# EAGLE schematic fpga_shield (EAGLE 9.2.2)
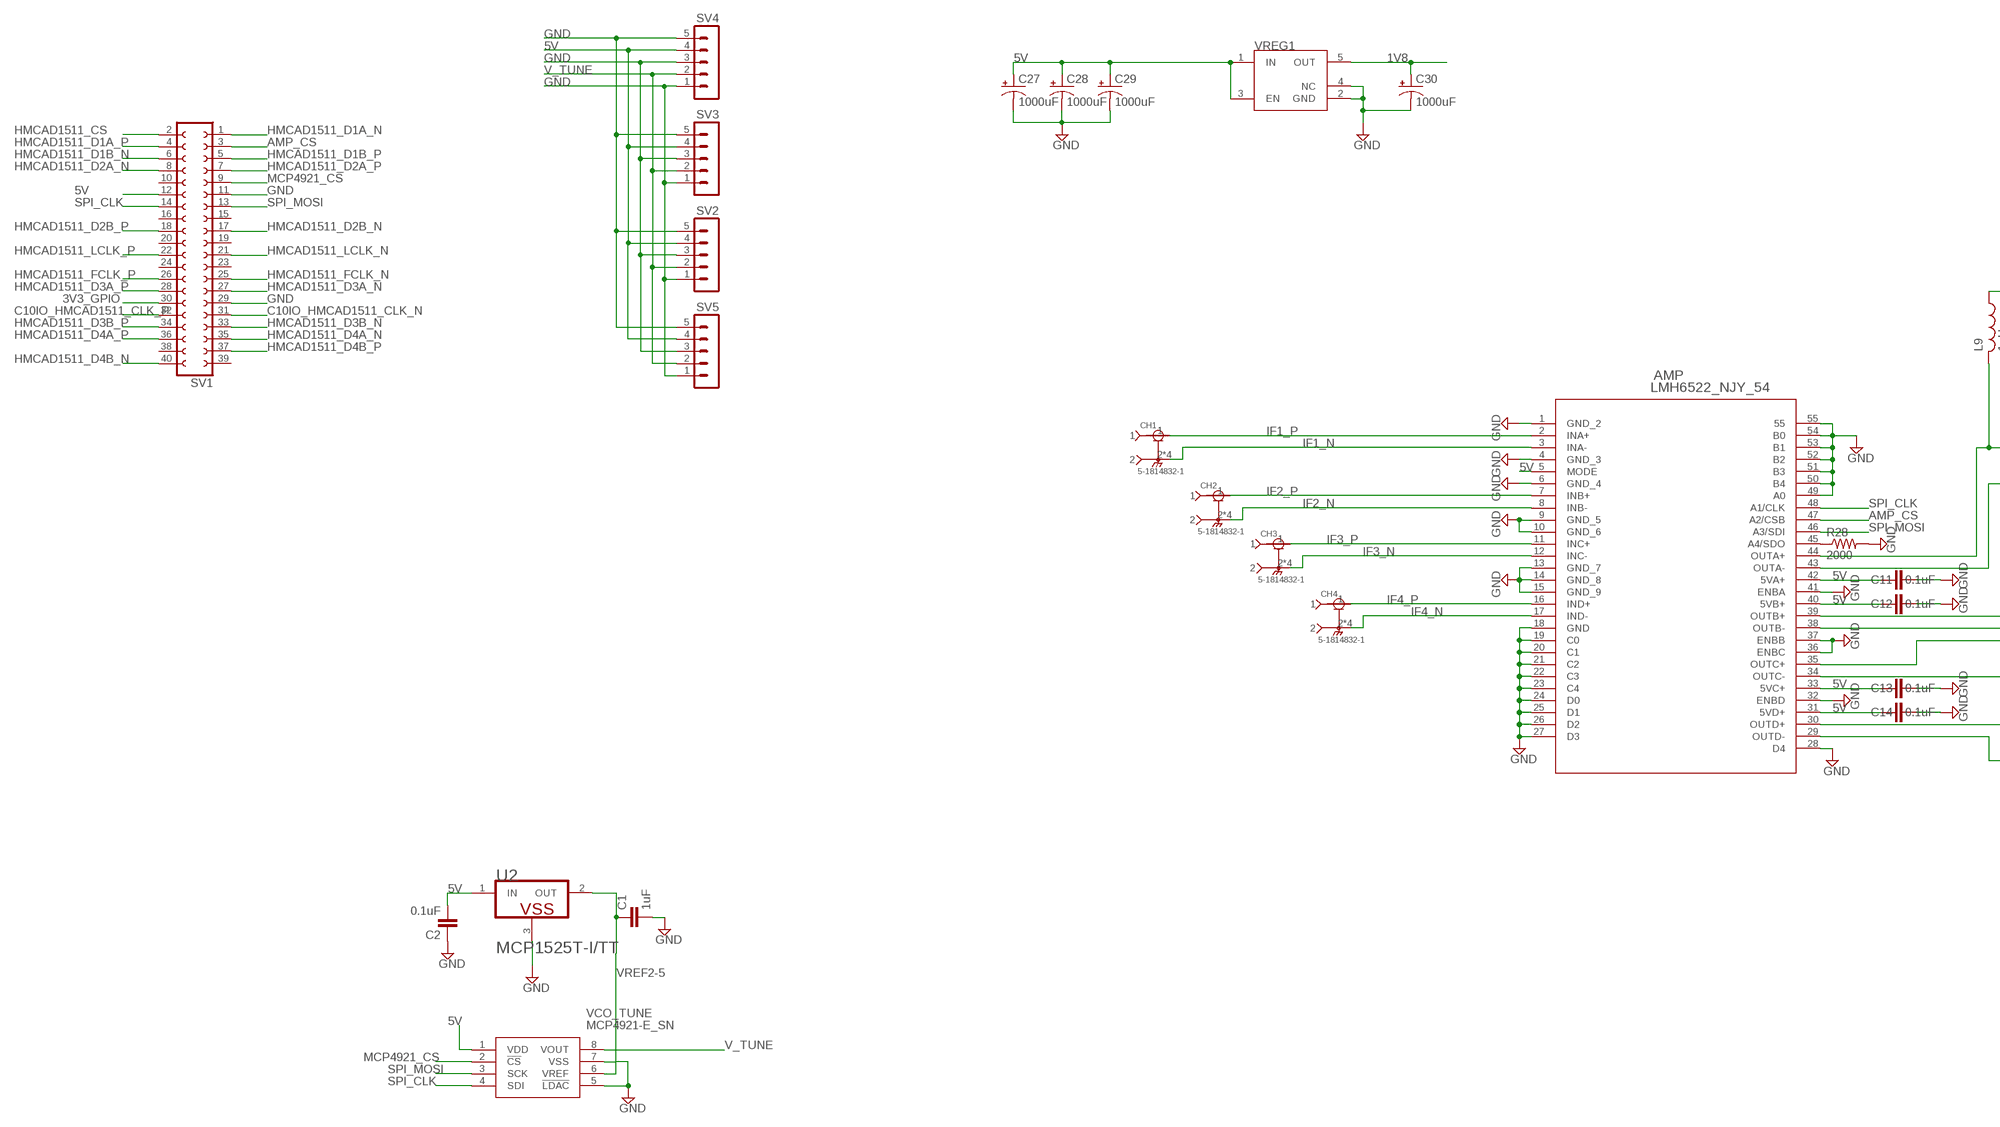
[diagram p0: schematic, sheet 1, part 1 of 2]
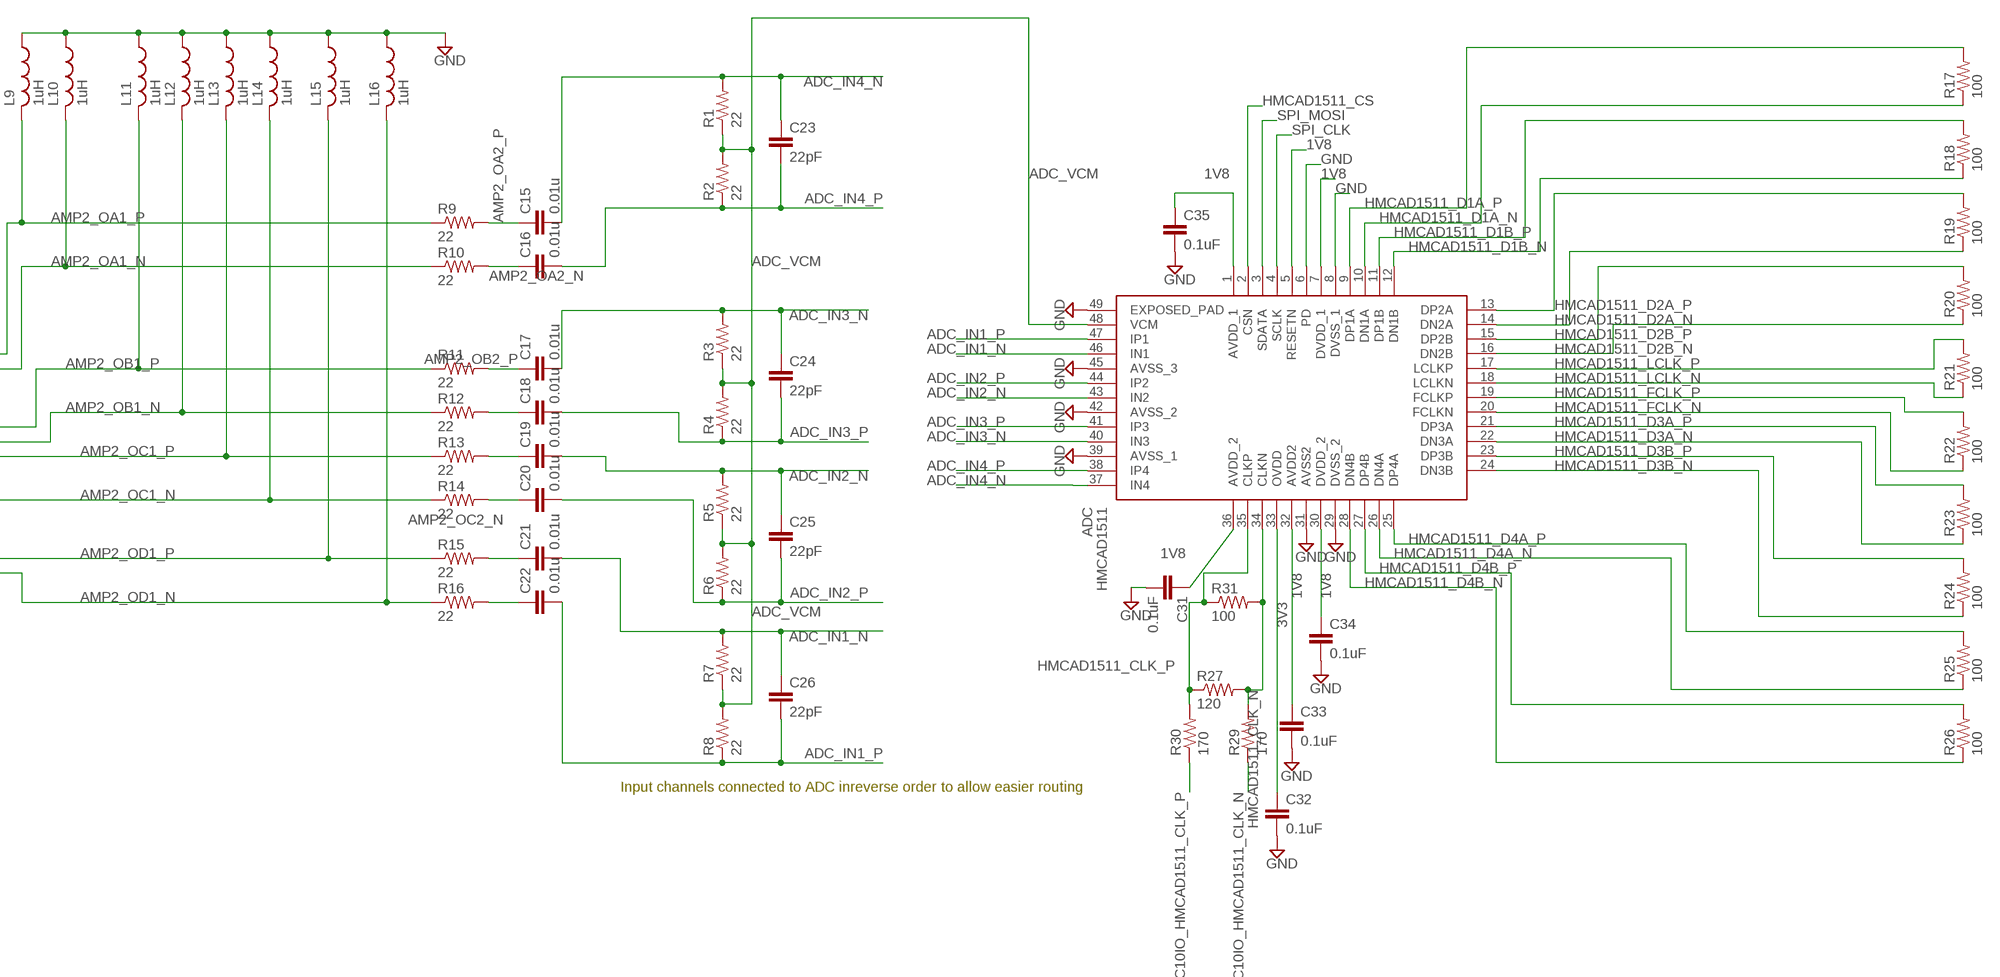
[diagram p1: schematic, sheet 1, part 2 of 2]

## Parts
ADC  HMCAD1511  [QFN50P700X700X100-49N]
AMP  LMH6522_NJY_54  [SQA54A]
C1  1uF  C-EUC0805  [C0805]
C2  0.1uF  C-EUC0805  [C0805]
C11  0.1uF  C-EUC0805  [C0805]
C12  0.1uF  C-EUC0805  [C0805]
C13  0.1uF  C-EUC0805  [C0805]
C14  0.1uF  C-EUC0805  [C0805]
C15  0.01u  C-EUC0805  [C0805]
C16  0.01u  C-EUC0805  [C0805]
C17  0.01u  C-EUC0805  [C0805]
C18  0.01u  C-EUC0805  [C0805]
C19  0.01u  C-EUC0805  [C0805]
C20  0.01u  C-EUC0805  [C0805]
C21  0.01u  C-EUC0805  [C0805]
C22  0.01u  C-EUC0805  [C0805]
C23  22pF  C-EUC0805  [C0805]
C24  22pF  C-EUC0805  [C0805]
C25  22pF  C-EUC0805  [C0805]
C26  22pF  C-EUC0805  [C0805]
C27  1000uF  CPOL-US150CLZ-1010  [150CLZ-1010]
C28  1000uF  CPOL-US150CLZ-1010  [150CLZ-1010]
C29  1000uF  CPOL-US150CLZ-1010  [150CLZ-1010]
C30  1000uF  CPOL-US150CLZ-1010  [150CLZ-1010]
C31  0.1uF  C-EUC0805  [C0805]
C32  0.1uF  C-EUC0805  [C0805]
C33  0.1uF  C-EUC0805  [C0805]
C34  0.1uF  C-EUC0805  [C0805]
C35  0.1uF  C-EUC0805  [C0805]
CH1  5-1814832-1  [TE_5-1814832-1]
CH2  5-1814832-1  [TE_5-1814832-1]
CH3  5-1814832-1  [TE_5-1814832-1]
CH4  5-1814832-1  [TE_5-1814832-1]
L9  1uH  L2012M  [INDC2518X180]
L10  1uH  L2012M  [INDC2518X180]
L11  1uH  L2012M  [INDC2518X180]
L12  1uH  L2012M  [INDC2518X180]
L13  1uH  L2012M  [INDC2518X180]
L14  1uH  L2012M  [INDC2518X180]
L15  1uH  L2012M  [INDC2518X180]
L16  1uH  L2012M  [INDC2518X180]
R1  22  R-US_R0805  [R0805]
R2  22  R-US_R0805  [R0805]
R3  22  R-US_R0805  [R0805]
R4  22  R-US_R0805  [R0805]
R5  22  R-US_R0805  [R0805]
R6  22  R-US_R0805  [R0805]
R7  22  R-US_R0805  [R0805]
R8  22  R-US_R0805  [R0805]
R9  22  R-US_R0805  [R0805]
R10  22  R-US_R0805  [R0805]
R11  22  R-US_R0805  [R0805]
R12  22  R-US_R0805  [R0805]
R13  22  R-US_R0805  [R0805]
R14  22  R-US_R0805  [R0805]
R15  22  R-US_R0805  [R0805]
R16  22  R-US_R0805  [R0805]
R17  100  R-US_R0402  [R0402]
R18  100  R-US_R0402  [R0402]
R19  100  R-US_R0402  [R0402]
R20  100  R-US_R0402  [R0402]
R21  100  R-US_R0402  [R0402]
R22  100  R-US_R0402  [R0402]
R23  100  R-US_R0402  [R0402]
R24  100  R-US_R0402  [R0402]
R25  100  R-US_R0402  [R0402]
R26  100  R-US_R0402  [R0402]
R27  120  R-US_R0402  [R0402]
R28  2000  R-US_R0805  [R0805]
R29  170  R-US_R0402  [R0402]
R30  170  R-US_R0402  [R0402]
R31  100  R-US_R0402  [R0402]
SV1  FE20-2  [FE20-2]
SV2  MA05-1  [MA05-1]
SV3  MA05-1  [MA05-1]
SV4  MA05-1  [MA05-1]
SV5  MA05-1  [MA05-1]
U2  MICROCHIP_MCP1525T-I-TTMICROCHIP_MCP1525T-I-TT_0_1  [MICROCHIP_MCP1525T-I-TT_1]
VCO_TUNE  MCP4921-E_SN  [SOIC127P600X175-8N]
VREG1  TLV75718PDBVR  [SOT95P240X110-5]

## Nets
1V8: ADC.1(AVDD_1) ADC.5(RESETN) ADC.7(DVDD_1) ADC.30(DVDD_2) ADC.32(AVDD2) ADC.36(AVDD_2) C30.+ C31.1 C33.1 C34.1 C35.1 VREG1.5(OUT)
3V3: ADC.33(OVDD) C32.1
3V3_GPIO: SV1.30
5V: AMP.5(MODE) AMP.31(5VD+) AMP.33(5VC+) AMP.40(5VB+) AMP.42(5VA+) C2.2 C11.1 C12.1 C13.1 C14.1 C27.+ C28.+ C29.+ SV1.12 SV2.4 SV3.4 SV4.4 SV5.4 U2.1(IN) VCO_TUNE.1(VDD) VREG1.1(IN) VREG1.3(EN)
ADC_IN1_N [analog_diff]: ADC.46(IN1) C21.2 C26.1 R7.2
ADC_IN1_P [analog_diff]: ADC.47(IP1) C22.2 C26.2 R8.1
ADC_IN2_N [analog_diff]: ADC.43(IN2) C19.2 C25.1 R5.2
ADC_IN2_P [analog_diff]: ADC.44(IP2) C20.2 C25.2 R6.1
ADC_IN3_N [analog_diff]: ADC.40(IN3) C17.2 C24.1 R3.2
ADC_IN3_P [analog_diff]: ADC.41(IP3) C18.2 C24.2 R4.1
ADC_IN4_N [analog_diff]: ADC.37(IN4) C15.2 C23.1 R1.2
ADC_IN4_P [analog_diff]: ADC.38(IP4) C16.2 C23.2 R2.1
ADC_VCM: ADC.48(VCM) R1.1 R2.2 R3.1 R4.2 R5.1 R6.2 R7.1 R8.2
AMP2_OA1_N [analog_diff]: AMP.43(OUTA-) L10.2 R10.1
AMP2_OA1_P [analog_diff]: AMP.44(OUTA+) L9.2 R9.1
AMP2_OA2_N [analog_diff]: C16.1 R10.2
AMP2_OA2_P [analog_diff]: C15.1 R9.2
AMP2_OB1_N [analog_diff]: AMP.38(OUTB-) L12.2 R12.1
AMP2_OB1_P [analog_diff]: AMP.39(OUTB+) L11.2 R11.1
AMP2_OB2_N [analog_diff]: C18.1 R12.2
AMP2_OB2_P [analog_diff]: C17.1 R11.2
AMP2_OC1_N [analog_diff]: AMP.34(OUTC-) L14.2 R14.1
AMP2_OC1_P [analog_diff]: AMP.35(OUTC+) L13.2 R13.1
AMP2_OC2_N [analog_diff]: C20.1 R14.2
AMP2_OC2_P [analog_diff]: C19.1 R13.2
AMP2_OD1_N [analog_diff]: AMP.29(OUTD-) L16.2 R16.1
AMP2_OD1_P [analog_diff]: AMP.30(OUTD+) L15.2 R15.1
AMP2_OD2_N [analog_diff]: C22.1 R16.2
AMP2_OD2_P [analog_diff]: C21.1 R15.2
AMP_CS [spi_stuff]: AMP.47(A2/CSB) SV1.3
C10IO_HMCAD1511_CLK_N [digital_diff]: R29.1 SV1.31
C10IO_HMCAD1511_CLK_P [digital_diff]: R30.1 SV1.32
GND: ADC.6(PD) ADC.8(DVSS_1) ADC.29(DVSS_2) ADC.31(AVSS2) ADC.39(AVSS_1) ADC.42(AVSS_2) ADC.45(AVSS_3) ADC.49(EXPOSED_PAD) AMP.1(GND_2) AMP.4(GND_3) AMP.6(GND_4) AMP.9(GND_5) AMP.10(GND_6) AMP.13(GND_7) AMP.14(GND_8) AMP.15(GND_9) AMP.18(GND) AMP.19(C0) AMP.20(C1) AMP.21(C2) AMP.22(C3) AMP.23(C4) AMP.24(D0) AMP.25(D1) AMP.26(D2) AMP.27(D3) AMP.28(D4) AMP.32(ENBD) AMP.36(ENBC) AMP.37(ENBB) AMP.41(ENBA) AMP.49(A0) AMP.50(B4) AMP.51(B3) AMP.52(B2) AMP.53(B1) AMP.54(B0) AMP.55 C1.2 C2.1 C11.2 C12.2 C13.2 C14.2 C27.- C28.- C29.- C30.- C31.2 C32.2 C33.2 C34.2 C35.2 L9.1 L10.1 L11.1 L12.1 L13.1 L14.1 L15.1 L16.1 R28.2 SV1.11 SV1.29 SV2.1 SV2.3 SV2.5 SV3.1 SV3.3 SV3.5 SV4.1 SV4.3 SV4.5 SV5.1 SV5.3 SV5.5 U2.3(VSS) VCO_TUNE.5(!LDAC) VCO_TUNE.7(VSS) VREG1.2(GND) VREG1.4(NC)
HMCAD1511_CLK_N [digital_diff]: ADC.34(CLKN) R27.2 R29.2 R31.2
HMCAD1511_CLK_P [digital_diff]: ADC.35(CLKP) R27.1 R30.2 R31.1
HMCAD1511_CS [spi_stuff]: ADC.2(CSN) SV1.2
HMCAD1511_D1A_N [digital_diff]: ADC.10(DN1A) R17.1 SV1.1
HMCAD1511_D1A_P [digital_diff]: ADC.9(DP1A) R17.2 SV1.4
HMCAD1511_D1B_N [digital_diff]: ADC.12(DN1B) R18.1 SV1.6
HMCAD1511_D1B_P [digital_diff]: ADC.11(DP1B) R18.2 SV1.5
HMCAD1511_D2A_N [digital_diff]: ADC.14(DN2A) R19.1 SV1.8
HMCAD1511_D2A_P [digital_diff]: ADC.13(DP2A) R19.2 SV1.7
HMCAD1511_D2B_N [digital_diff]: ADC.16(DN2B) R20.1 SV1.17
HMCAD1511_D2B_P [digital_diff]: ADC.15(DP2B) R20.2 SV1.18
HMCAD1511_D3A_N [digital_diff]: ADC.22(DN3A) R23.1 SV1.27
HMCAD1511_D3A_P [digital_diff]: ADC.21(DP3A) R23.2 SV1.28
HMCAD1511_D3B_N [digital_diff]: ADC.24(DN3B) R24.1 SV1.33
HMCAD1511_D3B_P [digital_diff]: ADC.23(DP3B) R24.2 SV1.34
HMCAD1511_D4A_N [digital_diff]: ADC.26(DN4A) R25.1 SV1.35
HMCAD1511_D4A_P [digital_diff]: ADC.25(DP4A) R25.2 SV1.36
HMCAD1511_D4B_N [digital_diff]: ADC.28(DN4B) R26.1 SV1.40
HMCAD1511_D4B_P [digital_diff]: ADC.27(DP4B) R26.2 SV1.37
HMCAD1511_FCLK_N [digital_diff]: ADC.20(FCLKN) R22.1 SV1.25
HMCAD1511_FCLK_P [digital_diff]: ADC.19(FCLKP) R22.2 SV1.26
HMCAD1511_LCLK_N [digital_diff]: ADC.18(LCLKN) R21.1 SV1.21
HMCAD1511_LCLK_P [digital_diff]: ADC.17(LCLKP) R21.2 SV1.22
IF1_N [analog_diff]: AMP.3(INA-) CH1.2 CH1.3 CH1.4 CH1.5
IF1_P [analog_diff]: AMP.2(INA+) CH1.1
IF2_N [analog_diff]: AMP.8(INB-) CH2.2 CH2.3 CH2.4 CH2.5
IF2_P [analog_diff]: AMP.7(INB+) CH2.1
IF3_N [analog_diff]: AMP.12(INC-) CH3.2 CH3.3 CH3.4 CH3.5
IF3_P [analog_diff]: AMP.11(INC+) CH3.1
IF4_N [analog_diff]: AMP.17(IND-) CH4.2 CH4.3 CH4.4 CH4.5
IF4_P [analog_diff]: AMP.16(IND+) CH4.1
MCP4921_CS [spi_stuff]: SV1.9 VCO_TUNE.2(!CS)
N$2: AMP.45(A4/SDO) R28.1
SPI_CLK [spi_stuff]: ADC.4(SCLK) AMP.48(A1/CLK) SV1.14 VCO_TUNE.4(SDI)
SPI_MOSI [spi_stuff]: ADC.3(SDATA) AMP.46(A3/SDI) SV1.13 VCO_TUNE.3(SCK)
V_TUNE: SV2.2 SV3.2 SV4.2 SV5.2 VCO_TUNE.8(VOUT)
VREF2-5: C1.1 U2.2(OUT) VCO_TUNE.6(VREF)
Unconnected: SV1.10 SV1.15 SV1.16 SV1.19 SV1.20 SV1.23 SV1.24 SV1.38 SV1.39

## Notes on the sheet
- Input channels connected to ADC inreverse order to allow easier routing

## Library data of the parts
ADC = HMCAD1511:HMCAD1511: ANALOG DEVICES - HMCAD1511 - ADC, 8BIT, 1GSPS, SPI, QFN-48 Source: Datasheet <https://www.mouser.com/ds/2/609/hmcad1511-468305.pdf>; ARROW_PART_NUMBER: HMCAD1511; ARROW_PRICE/STOCK: https://www.arrow.com/en/products/hmcad1511/analog-devices; DESCRIPTION: ANALOG DEVICES - HMCAD1511 - ADC, 8BIT, 1GSPS, SPI, QFN-48; HEIGHT: 1mm; MANUFACTURER_NAME: Analog Devices; MANUFACTURER_PART_NUMBER: HMCAD1511
AMP = LMH6522:LMH6522_NJY_54; MANUFACTURER_PART_NUMBER: lmh6522_njy_54; VENDOR: Texas Instruments
C1 C2 C11-C26 C31-C35 = rcl:C-EU: CAPACITOR, European symbol; SPICEPREFIX: C
C27-C30 = rcl:CPOL-US: POLARIZED CAPACITOR, American symbol; SPICEPREFIX: C
CH1-CH4 = 5-1814832-1:5-1814832-1: SMA Str PCB Skt GZD; MANUFACTURER: TE Connectivity; PARTREV: B1; STANDARD: Manufacturer recommendations
L9-L16 = Passives:L2012M
R1-R31 = rcl:R-US_: RESISTOR, American symbol; SPICEPREFIX: R
SV1 = con-lsta:FE20-2: FEMALE HEADER; OC_FARNELL: unknown; OC_NEWARK: unknown
SV2-SV5 = con-lstb:MA05-1: PIN HEADER; OC_FARNELL: unknown; OC_NEWARK: unknown
U2 = MCP1525-TT:MICROCHIP_MCP1525T-I-TT: PM-REF-MCP15XX-SOT3; CIIVA_IDS: 983557; CODE__IPC: SOT23-3; DATASHEET_VERSION: revB, Feb-2005; FOOTPRINT_VARIANT_NAME_0: Level C; FOOTPRINT_VARIANT_NAME_1: Level B; FOOTPRINT_VARIANT_NAME_2: Level A; IMPORTED: yes; IMPORTED_FROM: vault; IMPORT_TS: 1521846197; MF: Microchip; MPN: MCP1525T-I/TT; PACKAGE: SOT-23-TT3; PACKAGE_DESCRIPTION: 3-Lead Plastic Small Outline Transistor (TT) [SOT-23]; PACKAGE_VERSION: revBB, Aug-2009; PREFIX: U; RELEASE_DATE: 1300348616; VAULT_GUID: 0C633425-3565-4664-BF59-D2B283F923EE; VAULT_REVISION: D08F1B2D-F08B-45C4-BEE8-83A8337E46DD
VCO_TUNE = MCP4921-E_SN:MCP4921-E_SN: Single 12-bit DAC SPI I/F,MCP4921-E/SN Source: Datasheet <http://ww1.microchip.com/downloads/en/DeviceDoc/22248a.pdf>; ALLIED_NUMBER: 70046155; ALLIED_PRICE/STOCK: http://www.alliedelec.com/microchip-technology-inc-mcp4921-e-sn/70046155/; ARROW_PART_NUMBER: MCP4921-E/SN; ARROW_PRICE/STOCK: https://www.arrow.com/en/products/mcp4921-esn/microchip-technology; DESCRIPTION: Single 12-bit DAC SPI I/F,MCP4921-E/SN; HEIGHT: 1.75mm; MANUFACTURER_NAME: Microchip; MANUFACTURER_PART_NUMBER: MCP4921-E/SN; RS_PART_NUMBER: 0402803P; RS_PRICE/STOCK: http://uk.rs-online.com/web/p/products/0402803P
VREG1 = Tl757p:TLV75718PDBVR: 1.8V/1A Fixed LDO Linear Regulator

## Net classes
1 digital_diff: width 0.15 mm
2 analog_diff: width 0.15 mm